# EAGLE schematic Komplet elektronik kredsløb (EAGLE 8.4.3)
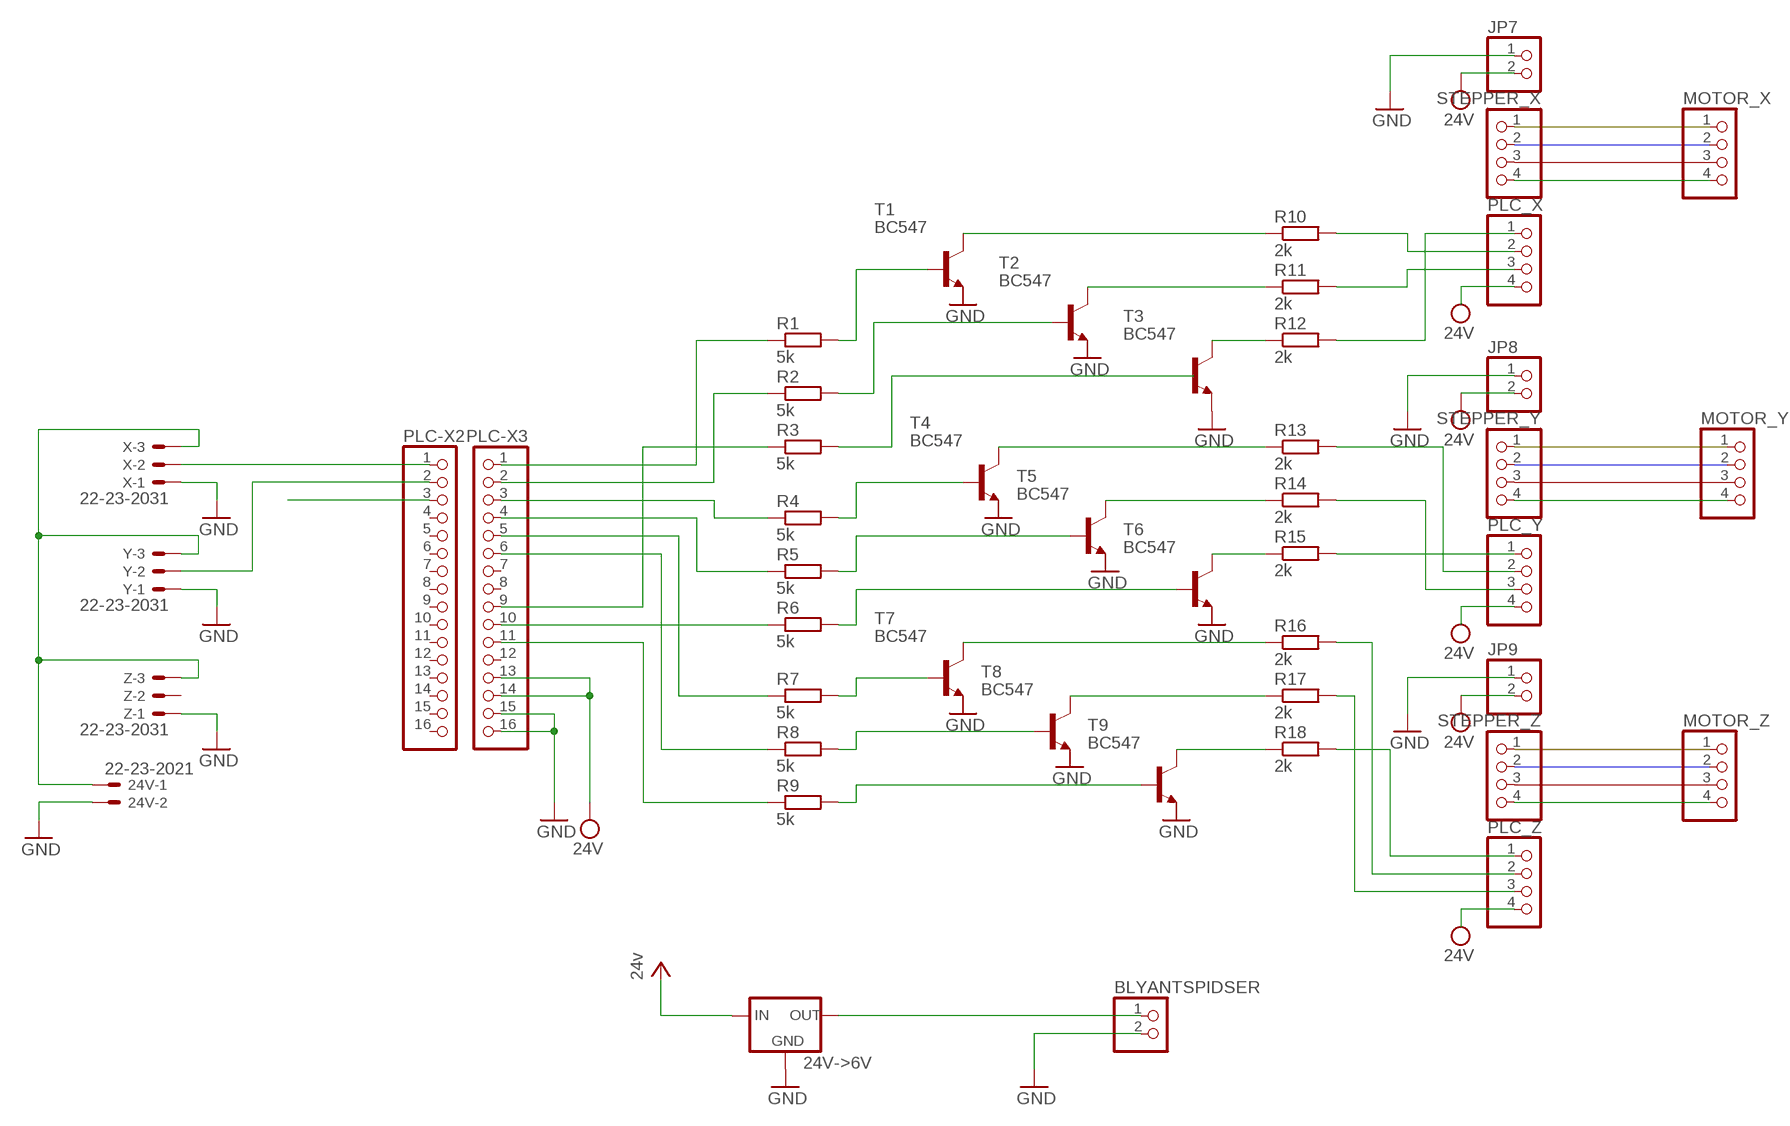
[diagram p0: schematic, sheet 1]

## Parts
24V  22-23-2021  [22-23-2021]
24V->6V  78XXS  [78XXS]
BLYANTSPIDSER  PINHD-1X2  [1X02]
JP7  PINHD-1X2  [1X02]
JP8  PINHD-1X2  [1X02]
JP9  PINHD-1X2  [1X02]
MOTOR_X  PINHD-1X4  [1X04]
MOTOR_Y  PINHD-1X4  [1X04]
MOTOR_Z  PINHD-1X4  [1X04]
PLC-X2  PINHD-1X16  [1X16]
PLC-X3  PINHD-1X16  [1X16]
PLC_X  PINHD-1X4  [1X04]
PLC_Y  PINHD-1X4  [1X04]
PLC_Z  PINHD-1X4  [1X04]
R1  5k  R-EU_0204/2V  [0204V]
R2  5k  R-EU_0204/2V  [0204V]
R3  5k  R-EU_0204/2V  [0204V]
R4  5k  R-EU_0204/2V  [0204V]
R5  5k  R-EU_0204/2V  [0204V]
R6  5k  R-EU_0204/2V  [0204V]
R7  5k  R-EU_0204/2V  [0204V]
R8  5k  R-EU_0204/2V  [0204V]
R9  5k  R-EU_0204/2V  [0204V]
R10  2k  R-EU_0204/2V  [0204V]
R11  2k  R-EU_0204/2V  [0204V]
R12  2k  R-EU_0204/2V  [0204V]
R13  2k  R-EU_0204/2V  [0204V]
R14  2k  R-EU_0204/2V  [0204V]
R15  2k  R-EU_0204/2V  [0204V]
R16  2k  R-EU_0204/2V  [0204V]
R17  2k  R-EU_0204/2V  [0204V]
R18  2k  R-EU_0204/2V  [0204V]
STEPPER_X  PINHD-1X4  [1X04]
STEPPER_Y  PINHD-1X4  [1X04]
STEPPER_Z  PINHD-1X4  [1X04]
T1  BC547  [TO92]
T2  BC547  [TO92]
T3  BC547  [TO92]
T4  BC547  [TO92]
T5  BC547  [TO92]
T6  BC547  [TO92]
T7  BC547  [TO92]
T8  BC547  [TO92]
T9  BC547  [TO92]
X  22-23-2031  [22-23-2031]
Y  22-23-2031  [22-23-2031]
Z  22-23-2031  [22-23-2031]

## Nets
GND: BLYANTSPIDSER.2 JP7.1 JP8.1 JP9.1 PLC-X3.15 PLC-X3.16 T3.1(E) Y.1
N$1: PLC-X2.1 X.2
N$2: PLC-X2.2 Y.2
N$3: PLC-X2.3
N$4: 24V.1 X.3 Y.3 Z.3
N$5: 24V.2 ; supply symbol labelled GND
N$6: Z.1 ; supply symbol labelled GND
N$7: PLC-X3.1 R1.1
N$8: X.1 ; supply symbol labelled GND
N$9: PLC-X3.2 R2.1
N$10: PLC-X3.3 R4.1
N$11: PLC-X3.4 R5.1
N$12: PLC-X3.5 R7.1
N$13: PLC-X3.6 R8.1
N$14: PLC-X3.9 R3.1
N$15: PLC-X3.10 R6.1
N$16: PLC-X3.11 R9.1
N$17: R9.2 T9.2(B)
N$18: R1.2 T1.2(B)
N$19: R2.2 T2.2(B)
N$20: PLC_X.1 R12.2
N$21: R4.2 T4.2(B)
N$22: R5.2 T5.2(B)
N$23: R6.2 T6.2(B)
N$24: R7.2 T7.2(B)
N$25: R8.2
N$26: R10.1 T1.3(C)
N$27: R11.1 T2.3(C)
N$28: R12.1 T3.3(C)
N$29: R13.1 T4.3(C)
N$30: R14.1 T5.3(C)
N$31: R15.1 T6.3(C)
N$32: R16.1 T7.3(C)
N$33: R17.1 T8.3(C)
N$34: R18.1 T9.3(C)
N$35: R3.2
N$36: PLC_X.3 R11.2
N$37: PLC_X.2 R10.2
N$38: PLC_X.4
N$39: PLC_Y.1 R15.2
N$40: PLC_Y.3 R14.2
N$41: PLC_Y.2 R13.2
N$42: PLC_Y.4
N$43: PLC_Z.1 R18.2
N$44: PLC_Z.3 R17.2
N$45: PLC_Z.2 R16.2
N$46: PLC_Z.4
N$47: MOTOR_X.4 STEPPER_X.4
N$48: MOTOR_Y.4 STEPPER_Y.4
N$49: MOTOR_Z.4 STEPPER_Z.4
N$51: 24V->6V.OUT BLYANTSPIDSER.1
VCC: 24V->6V.IN JP7.2 JP8.2 JP9.2 PLC-X3.13 PLC-X3.14 ; supply symbol labelled 24V, 24v
Unconnected: 24V->6V.GND MOTOR_X.1 MOTOR_X.2 MOTOR_X.3 MOTOR_Y.1 MOTOR_Y.2 MOTOR_Y.3 MOTOR_Z.1 MOTOR_Z.2 MOTOR_Z.3 PLC-X2.4 PLC-X2.5 PLC-X2.6 PLC-X2.7 PLC-X2.8 PLC-X2.9 PLC-X2.10 PLC-X2.11 PLC-X2.12 PLC-X2.13 PLC-X2.14 PLC-X2.15 PLC-X2.16 PLC-X3.7 PLC-X3.8 PLC-X3.12 STEPPER_X.1 STEPPER_X.2 STEPPER_X.3 STEPPER_Y.1 STEPPER_Y.2 STEPPER_Y.3 STEPPER_Z.1 STEPPER_Z.2 STEPPER_Z.3 T1.1(E) T2.1(E) T3.2(B) T4.1(E) T5.1(E) T6.1(E) T7.1(E) T8.1(E) T8.2(B) T9.1(E) Z.2

## Library data of the parts
24V = con-molex:22-23-2021: .100" (2.54mm) Center Header - 2 Pin; MF: MOLEX; MPN: 22-23-2021; OC_FARNELL: 1462926; OC_NEWARK: 25C3832
24V->6V = v-reg:78XXS: VOLTAGE REGULATOR
BLYANTSPIDSER JP7-JP9 = pinhead:PINHD-1X2: PIN HEADER
MOTOR_X MOTOR_Y MOTOR_Z PLC_X PLC_Y PLC_Z STEPPER_X STEPPER_Y STEPPER_Z = pinhead:PINHD-1X4: PIN HEADER
PLC-X2 PLC-X3 = pinhead:PINHD-1X16: PIN HEADER
R1-R18 = resistor:R-EU_: RESISTOR, European symbol
T1-T9 = transistor:BC547: NPN TRANSISTOR
X Y Z = con-molex:22-23-2031: .100" (2.54mm) Center Header - 3 Pin; MF: MOLEX; MPN: 22-23-2031; OC_FARNELL: 1462950; OC_NEWARK: 30C0862